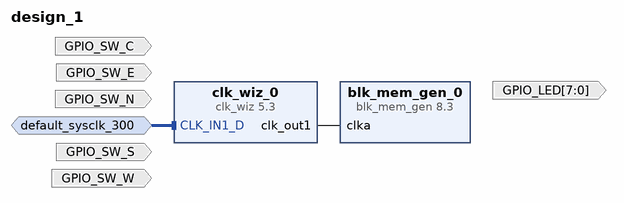
[diagram p0: block diagram of the top level]
# Vivado block design design_1, xcku040-ffva1156-2-e, Vivado 2016.4
create_bd_design design_1

create_bd_intf_port -mode Slave -vlnv xilinx.com:interface:diff_clock_rtl:1.0 default_sysclk_300
set_property -dict {CONFIG.FREQ_HZ 300000000} [get_bd_intf_ports default_sysclk_300]
create_bd_port -dir I -type data GPIO_SW_N
create_bd_port -dir I -type data GPIO_SW_E
create_bd_port -dir I -type data GPIO_SW_S
create_bd_port -dir I GPIO_SW_W
create_bd_port -dir I -type data GPIO_SW_C
create_bd_port -dir O -from 7 -to 0 -type data GPIO_LED

create_bd_cell -type ip -vlnv xilinx.com:ip:blk_mem_gen:8.3 blk_mem_gen_0
create_bd_cell -type ip -vlnv xilinx.com:ip:clk_wiz:5.3 clk_wiz_0
set_property -dict {CONFIG.USE_BOARD_FLOW true CONFIG.CLK_IN1_BOARD_INTERFACE default_sysclk_300} [get_bd_cells clk_wiz_0]

# ---- connections ----

connect_bd_intf_net -intf_net default_sysclk_300_1 [get_bd_intf_ports default_sysclk_300] [get_bd_intf_pins clk_wiz_0/CLK_IN1_D]
connect_bd_net [get_bd_pins clk_wiz_0/clk_out1] [get_bd_pins blk_mem_gen_0/clka]

validate_bd_design
save_bd_design
